# Altium schematic sheet MCU.SchDoc
size A4
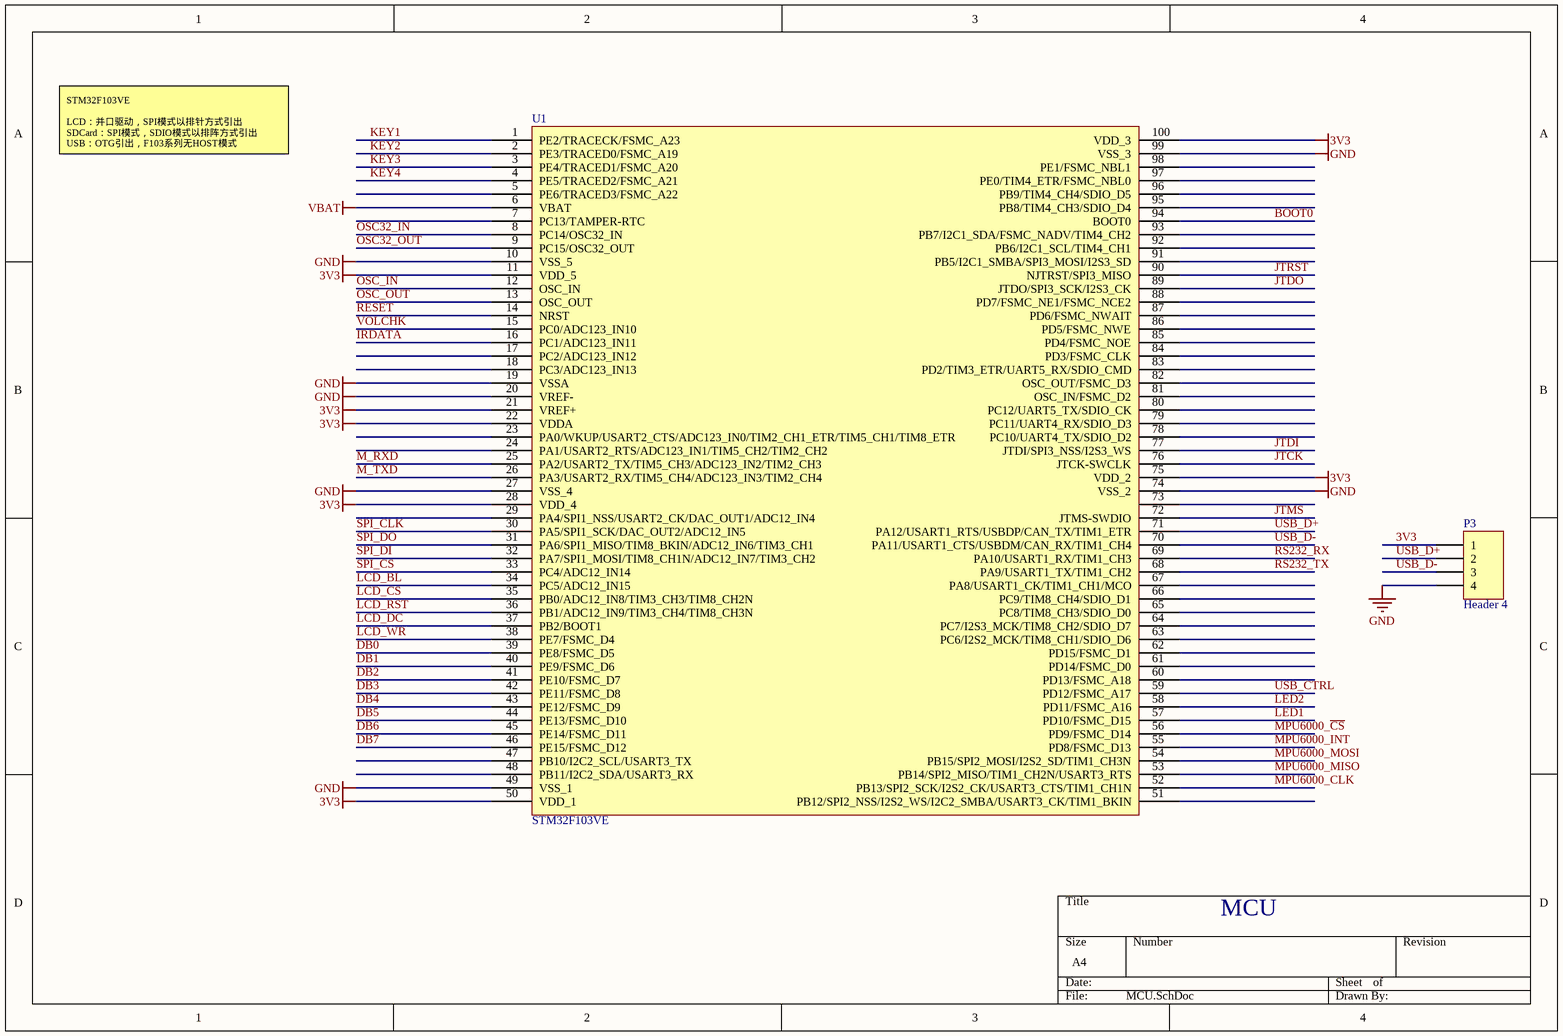
[diagram p0: MCU.SchDoc]

## Parts
P3  Header 4  [HDR1X4]
U1  STM32F103VE  [LQFP100_M]

## Nets
3V3: P3.1 U1.11(VDD_5) U1.21(VREF+) U1.22(VDDA) U1.28(VDD_4) U1.50(VDD_1) U1.75(VDD_2) U1.100(VDD_3)
GND: P3.4 U1.10(VSS_5) U1.19(VSSA) U1.20(VREF-) U1.27(VSS_4) U1.49(VSS_1) U1.74(VSS_2) U1.99(VSS_3)
VBAT: U1.6(VBAT)
BOOT0: U1.94(BOOT0)
DB0: U1.39(PE8/FSMC_D5)
DB1: U1.40(PE9/FSMC_D6)
DB2: U1.41(PE10/FSMC_D7)
DB3: U1.42(PE11/FSMC_D8)
DB4: U1.43(PE12/FSMC_D9)
DB5: U1.44(PE13/FSMC_D10)
DB6: U1.45(PE14/FSMC_D11)
DB7: U1.46(PE15/FSMC_D12)
IRDATA: U1.16(PC1/ADC123_IN11)
JTCK: U1.76(JTCK-SWCLK)
JTDI: U1.77(JTDI/SPI3_NSS/I2S3_WS)
JTDO: U1.89(JTDO/SPI3_SCK/I2S3_CK)
JTMS: U1.72(JTMS-SWDIO)
JTRST: U1.90(NJTRST/SPI3_MISO)
KEY1: U1.1(PE2/TRACECK/FSMC_A23)
KEY2: U1.2(PE3/TRACED0/FSMC_A19)
KEY3: U1.3(PE4/TRACED1/FSMC_A20)
KEY4: U1.4(PE5/TRACED2/FSMC_A21)
LCD_BL: U1.34(PC5/ADC12_IN15)
LCD_CS: U1.35(PB0/ADC12_IN8/TIM3_CH3/TIM8_CH2N)
LCD_DC: U1.37(PB2/BOOT1)
LCD_RST: U1.36(PB1/ADC12_IN9/TIM3_CH4/TIM8_CH3N)
LCD_WR: U1.38(PE7/FSMC_D4)
LED1: U1.57(PD10/FSMC_D15)
LED2: U1.58(PD11/FSMC_A16)
M_RXD: U1.25(PA2/USART2_TX/TIM5_CH3/ADC123_IN2/TIM2_CH3)
M_TXD: U1.26(PA3/USART2_RX/TIM5_CH4/ADC123_IN3/TIM2_CH4)
MPU6000_~{CS}: U1.56(PD9/FSMC_D14)
MPU6000_CLK: U1.52(PB13/SPI2_SCK/I2S2_CK/USART3_CTS/TIM1_CH1N)
MPU6000_INT: U1.55(PD8/FSMC_D13)
MPU6000_MISO: U1.53(PB14/SPI2_MISO/TIM1_CH2N/USART3_RTS)
MPU6000_MOSI: U1.54(PB15/SPI2_MOSI/I2S2_SD/TIM1_CH3N)
OSC32_IN: U1.8(PC14/OSC32_IN)
OSC32_OUT: U1.9(PC15/OSC32_OUT)
OSC_IN: U1.12(OSC_IN)
OSC_OUT: U1.13(OSC_OUT)
RESET: U1.14(NRST)
RS232_RX: U1.69(PA10/USART1_RX/TIM1_CH3)
RS232_TX: U1.68(PA9/USART1_TX/TIM1_CH2)
SPI_~{CS}: U1.33(PC4/ADC12_IN14)
SPI_CLK: U1.30(PA5/SPI1_SCK/DAC_OUT2/ADC12_IN5)
SPI_DI: U1.32(PA7/SPI1_MOSI/TIM8_CH1N/ADC12_IN7/TIM3_CH2)
SPI_DO: U1.31(PA6/SPI1_MISO/TIM8_BKIN/ADC12_IN6/TIM3_CH1)
USB_CTRL: U1.59(PD12/FSMC_A17)
USB_D+: P3.2 U1.71(PA12/USART1_RTS/USBDP/CAN_TX/TIM1_ETR)
USB_D-: P3.3 U1.70(PA11/USART1_CTS/USBDM/CAN_RX/TIM1_CH4)
VOLCHK: U1.15(PC0/ADC123_IN10)

Not connected (* = marked no-connect by the designer): U1 5(PE6/TRACED3/FSMC_A22) 7(PC13/TAMPER-RTC) 17(PC2/ADC123_IN12) 18(PC3/ADC123_IN13) 23(PA0/WKUP/USART2_CTS/ADC123_IN0/TIM2_CH1_ETR/TIM5_CH1/TIM8_ETR) 24(PA1/USART2_RTS/ADC123_IN1/TIM5_CH2/TIM2_CH2) 29(PA4/SPI1_NSS/USART2_CK/DAC_OUT1/ADC12_IN4) 47(PB10/I2C2_SCL/USART3_TX) 48(PB11/I2C2_SDA/USART3_RX) 51(PB12/SPI2_NSS/I2S2_WS/I2C2_SMBA/USART3_CK/TIM1_BKIN) 60(PD13/FSMC_A18) 61(PD14/FSMC_D0) 62(PD15/FSMC_D1) 63(PC6/I2S2_MCK/TIM8_CH1/SDIO_D6) 64(PC7/I2S3_MCK/TIM8_CH2/SDIO_D7) 65(PC8/TIM8_CH3/SDIO_D0) 66(PC9/TIM8_CH4/SDIO_D1) 67(PA8/USART1_CK/TIM1_CH1/MCO) 73 78(PC10/UART4_TX/SDIO_D2) 79(PC11/UART4_RX/SDIO_D3) 80(PC12/UART5_TX/SDIO_CK) 81(OSC_IN/FSMC_D2) 82(OSC_OUT/FSMC_D3) 83(PD2/TIM3_ETR/UART5_RX/SDIO_CMD) 84(PD3/FSMC_CLK) 85(PD4/FSMC_NOE) 86(PD5/FSMC_NWE) 87(PD6/FSMC_NWAIT) 88(PD7/FSMC_NE1/FSMC_NCE2) 91(PB5/I2C1_SMBA/SPI3_MOSI/I2S3_SD) 92(PB6/I2C1_SCL/TIM4_CH1) 93(PB7/I2C1_SDA/FSMC_NADV/TIM4_CH2) 95(PB8/TIM4_CH3/SDIO_D4) 96(PB9/TIM4_CH4/SDIO_D5) 97(PE0/TIM4_ETR/FSMC_NBL0) 98(PE1/FSMC_NBL1)

## Notes on the sheet
- STM32F103VE
  LCD：并口驱动，SPI模式以排针方式引出
  SDCard：SPI模式，SDIO模式以排阵方式引出
  USB：OTG引出，F103系列无HOST模式
- MCU

## Library data of the parts
P3 = Header 4: Header, 4-Pin; LatestRevisionDate: 17-Jul-2002; LatestRevisionNote: Re-released for DXP Platform.; Publisher: Altium Limited